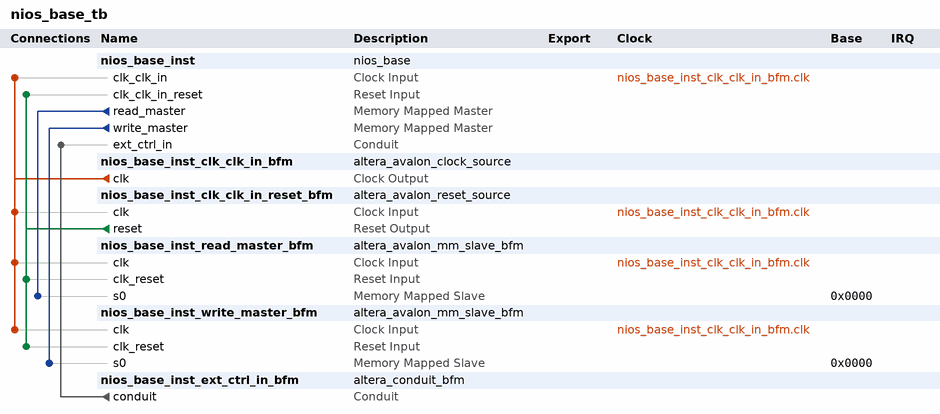
[diagram p0: system contents]
# Platform Designer (Qsys) system nios_base_tb
# Parameters at their usual value, and those the tool derives, are not listed.
package require -exact qsys 11.0
create_system nios_base_tb
set_project_property DEVICE_FAMILY STRATIXIV

add_instance nios_base_inst nios_base 1.0

add_instance nios_base_inst_clk_clk_in_bfm altera_avalon_clock_source 11.0
set_instance_parameter_value nios_base_inst_clk_clk_in_bfm CLOCK_RATE 50

add_instance nios_base_inst_clk_clk_in_reset_bfm altera_avalon_reset_source 11.0
set_instance_parameter_value nios_base_inst_clk_clk_in_reset_bfm ASSERT_HIGH_RESET 0
set_instance_parameter_value nios_base_inst_clk_clk_in_reset_bfm INITIAL_RESET_CYCLES 50

add_instance nios_base_inst_read_master_bfm altera_avalon_mm_slave_bfm 11.0
set_instance_parameter_value nios_base_inst_read_master_bfm AV_ADDRESS_W 32
set_instance_parameter_value nios_base_inst_read_master_bfm AV_SYMBOL_W 8
set_instance_parameter_value nios_base_inst_read_master_bfm AV_NUMSYMBOLS 4
set_instance_parameter_value nios_base_inst_read_master_bfm AV_BURSTCOUNT_W 1
set_instance_parameter_value nios_base_inst_read_master_bfm AV_READRESPONSE_W 1
set_instance_parameter_value nios_base_inst_read_master_bfm AV_WRITERESPONSE_W 1
set_instance_parameter_value nios_base_inst_read_master_bfm USE_READ 1
set_instance_parameter_value nios_base_inst_read_master_bfm USE_WRITE 0
set_instance_parameter_value nios_base_inst_read_master_bfm USE_ADDRESS 1
set_instance_parameter_value nios_base_inst_read_master_bfm USE_BYTE_ENABLE 1
set_instance_parameter_value nios_base_inst_read_master_bfm USE_BURSTCOUNT 0
set_instance_parameter_value nios_base_inst_read_master_bfm USE_READ_DATA 1
set_instance_parameter_value nios_base_inst_read_master_bfm USE_READ_DATA_VALID 1
set_instance_parameter_value nios_base_inst_read_master_bfm USE_WRITE_DATA 0
set_instance_parameter_value nios_base_inst_read_master_bfm USE_BEGIN_TRANSFER 0
set_instance_parameter_value nios_base_inst_read_master_bfm USE_BEGIN_BURST_TRANSFER 0
set_instance_parameter_value nios_base_inst_read_master_bfm USE_ARBITERLOCK 0
set_instance_parameter_value nios_base_inst_read_master_bfm USE_LOCK 0
set_instance_parameter_value nios_base_inst_read_master_bfm USE_DEBUGACCESS 0
set_instance_parameter_value nios_base_inst_read_master_bfm USE_WAIT_REQUEST 1
set_instance_parameter_value nios_base_inst_read_master_bfm USE_TRANSACTIONID 0
set_instance_parameter_value nios_base_inst_read_master_bfm USE_WRITERESPONSE 0
set_instance_parameter_value nios_base_inst_read_master_bfm USE_READRESPONSE 0
set_instance_parameter_value nios_base_inst_read_master_bfm USE_CLKEN 0
set_instance_parameter_value nios_base_inst_read_master_bfm ASSERT_HIGH_RESET 1
set_instance_parameter_value nios_base_inst_read_master_bfm ASSERT_HIGH_WAITREQUEST 1
set_instance_parameter_value nios_base_inst_read_master_bfm ASSERT_HIGH_READ 1
set_instance_parameter_value nios_base_inst_read_master_bfm ASSERT_HIGH_WRITE 1
set_instance_parameter_value nios_base_inst_read_master_bfm ASSERT_HIGH_BYTEENABLE 1
set_instance_parameter_value nios_base_inst_read_master_bfm ASSERT_HIGH_READDATAVALID 1
set_instance_parameter_value nios_base_inst_read_master_bfm ASSERT_HIGH_ARBITERLOCK 1
set_instance_parameter_value nios_base_inst_read_master_bfm ASSERT_HIGH_LOCK 1
set_instance_parameter_value nios_base_inst_read_master_bfm AV_BURST_LINEWRAP 0
set_instance_parameter_value nios_base_inst_read_master_bfm AV_BURST_BNDR_ONLY 0
set_instance_parameter_value nios_base_inst_read_master_bfm AV_MAX_PENDING_READS 1
set_instance_parameter_value nios_base_inst_read_master_bfm AV_FIX_READ_LATENCY 0
set_instance_parameter_value nios_base_inst_read_master_bfm AV_READ_WAIT_TIME 1
set_instance_parameter_value nios_base_inst_read_master_bfm AV_WRITE_WAIT_TIME 0
set_instance_parameter_value nios_base_inst_read_master_bfm REGISTER_WAITREQUEST 0
set_instance_parameter_value nios_base_inst_read_master_bfm AV_REGISTERINCOMINGSIGNALS 0
set_instance_parameter_value nios_base_inst_read_master_bfm ADDRESS_UNITS SYMBOLS

add_instance nios_base_inst_write_master_bfm altera_avalon_mm_slave_bfm 11.0
set_instance_parameter_value nios_base_inst_write_master_bfm AV_ADDRESS_W 32
set_instance_parameter_value nios_base_inst_write_master_bfm AV_SYMBOL_W 8
set_instance_parameter_value nios_base_inst_write_master_bfm AV_NUMSYMBOLS 4
set_instance_parameter_value nios_base_inst_write_master_bfm AV_BURSTCOUNT_W 1
set_instance_parameter_value nios_base_inst_write_master_bfm AV_READRESPONSE_W 1
set_instance_parameter_value nios_base_inst_write_master_bfm AV_WRITERESPONSE_W 1
set_instance_parameter_value nios_base_inst_write_master_bfm USE_READ 0
set_instance_parameter_value nios_base_inst_write_master_bfm USE_WRITE 1
set_instance_parameter_value nios_base_inst_write_master_bfm USE_ADDRESS 1
set_instance_parameter_value nios_base_inst_write_master_bfm USE_BYTE_ENABLE 1
set_instance_parameter_value nios_base_inst_write_master_bfm USE_BURSTCOUNT 0
set_instance_parameter_value nios_base_inst_write_master_bfm USE_READ_DATA 0
set_instance_parameter_value nios_base_inst_write_master_bfm USE_READ_DATA_VALID 0
set_instance_parameter_value nios_base_inst_write_master_bfm USE_WRITE_DATA 1
set_instance_parameter_value nios_base_inst_write_master_bfm USE_BEGIN_TRANSFER 0
set_instance_parameter_value nios_base_inst_write_master_bfm USE_BEGIN_BURST_TRANSFER 0
set_instance_parameter_value nios_base_inst_write_master_bfm USE_ARBITERLOCK 0
set_instance_parameter_value nios_base_inst_write_master_bfm USE_LOCK 0
set_instance_parameter_value nios_base_inst_write_master_bfm USE_DEBUGACCESS 0
set_instance_parameter_value nios_base_inst_write_master_bfm USE_WAIT_REQUEST 1
set_instance_parameter_value nios_base_inst_write_master_bfm USE_TRANSACTIONID 0
set_instance_parameter_value nios_base_inst_write_master_bfm USE_WRITERESPONSE 0
set_instance_parameter_value nios_base_inst_write_master_bfm USE_READRESPONSE 0
set_instance_parameter_value nios_base_inst_write_master_bfm USE_CLKEN 0
set_instance_parameter_value nios_base_inst_write_master_bfm ASSERT_HIGH_RESET 1
set_instance_parameter_value nios_base_inst_write_master_bfm ASSERT_HIGH_WAITREQUEST 1
set_instance_parameter_value nios_base_inst_write_master_bfm ASSERT_HIGH_READ 1
set_instance_parameter_value nios_base_inst_write_master_bfm ASSERT_HIGH_WRITE 1
set_instance_parameter_value nios_base_inst_write_master_bfm ASSERT_HIGH_BYTEENABLE 1
set_instance_parameter_value nios_base_inst_write_master_bfm ASSERT_HIGH_READDATAVALID 1
set_instance_parameter_value nios_base_inst_write_master_bfm ASSERT_HIGH_ARBITERLOCK 1
set_instance_parameter_value nios_base_inst_write_master_bfm ASSERT_HIGH_LOCK 1
set_instance_parameter_value nios_base_inst_write_master_bfm AV_BURST_LINEWRAP 0
set_instance_parameter_value nios_base_inst_write_master_bfm AV_BURST_BNDR_ONLY 0
set_instance_parameter_value nios_base_inst_write_master_bfm AV_MAX_PENDING_READS 0
set_instance_parameter_value nios_base_inst_write_master_bfm AV_FIX_READ_LATENCY 0
set_instance_parameter_value nios_base_inst_write_master_bfm AV_READ_WAIT_TIME 1
set_instance_parameter_value nios_base_inst_write_master_bfm AV_WRITE_WAIT_TIME 0
set_instance_parameter_value nios_base_inst_write_master_bfm REGISTER_WAITREQUEST 0
set_instance_parameter_value nios_base_inst_write_master_bfm AV_REGISTERINCOMINGSIGNALS 0
set_instance_parameter_value nios_base_inst_write_master_bfm ADDRESS_UNITS SYMBOLS

add_instance nios_base_inst_ext_ctrl_in_bfm altera_conduit_bfm 11.0
set_instance_parameter_value nios_base_inst_ext_ctrl_in_bfm SIGNAL_WIDTHS 4
set_instance_parameter_value nios_base_inst_ext_ctrl_in_bfm SIGNAL_DIRECTIONS output

# connections
add_connection nios_base_inst_clk_clk_in_bfm.clk nios_base_inst.clk_clk_in clock
add_connection nios_base_inst_clk_clk_in_bfm.clk nios_base_inst_clk_clk_in_reset_bfm.clk clock
add_connection nios_base_inst_clk_clk_in_bfm.clk nios_base_inst_read_master_bfm.clk clock
add_connection nios_base_inst_clk_clk_in_bfm.clk nios_base_inst_write_master_bfm.clk clock
add_connection nios_base_inst_clk_clk_in_reset_bfm.reset nios_base_inst.clk_clk_in_reset reset
add_connection nios_base_inst_clk_clk_in_reset_bfm.reset nios_base_inst_read_master_bfm.clk_reset reset
add_connection nios_base_inst_clk_clk_in_reset_bfm.reset nios_base_inst_write_master_bfm.clk_reset reset
add_connection nios_base_inst.read_master nios_base_inst_read_master_bfm.s0 avalon
set_connection_parameter_value nios_base_inst.read_master/nios_base_inst_read_master_bfm.s0 baseAddress 0x0000
add_connection nios_base_inst.write_master nios_base_inst_write_master_bfm.s0 avalon
set_connection_parameter_value nios_base_inst.write_master/nios_base_inst_write_master_bfm.s0 baseAddress 0x0000
add_connection nios_base_inst_ext_ctrl_in_bfm.conduit nios_base_inst.ext_ctrl_in conduit

save_system nios_base_tb.qsys
